# Altium schematic sheet CAN.SchDoc
size A4
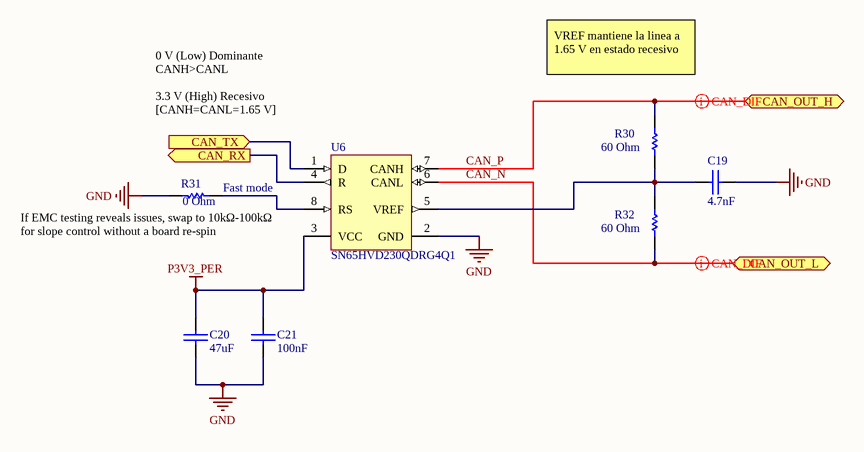
[diagram p0: CAN.SchDoc]

## Parts
C19  4.7nF  [0603C]
C20  47uF  [0603C]
C21  100nF  [0603C]
R30  60 Ohm  [0603R]
R31  0 Ohm  [0603R]
R32  60 Ohm  [0603R]
U6  SN65HVD230QDRG4Q1  [D0008A_M]

## Ports
CAN_OUT_H (bidir), CAN_OUT_L (bidir), CAN_RX (out), CAN_TX (in)

## Nets
GND: C19.2 C20.1 C21.1 R31.2 U6.2(GND)
P3V3_PER: C20.2 C21.2 U6.3(VCC)
CAN_N: R32.1 U6.6(CANL) ; port CAN_OUT_L
CAN_P: R30.2 U6.7(CANH) ; port CAN_OUT_H
CAN_RX: U6.4(R) ; port CAN_RX
CAN_TX: U6.1(D) ; port CAN_TX
NetC19_1: C19.1 R30.1 R32.2 U6.5(VREF)
NetR31_1: R31.1 U6.8(RS)

## Layout directives
differential pair: CAN_N, CAN_P

## Notes on the sheet
- VREF mantiene la linea a 1.65 V en estado recesivo
- 0 V (Low) Dominante CANH>CANL
  3.3 V (High) Recesivo  [CANH=CANL=1.65 V]
- (near R31) Fast mode
- (near R31) If EMC testing reveals issues, swap to 10kΩ-100kΩ for slope control without a board re-spin

## Library data of the parts
C19-C21 = CAP: Capacitor
R30 R32 = Res1: Resistor; Value: 60; Ordered by: Subcon; Published: 8-Jun-2000; Revision: July-2002: Re-released for DXP Platform.; Publisher: Altium Limited
R31 = Res1: Resistor; Value: 1K; Published: 8-Jun-2000; Revision: July-2002: Re-released for DXP Platform.; Publisher: Altium Limited
U6 = CMP-0315-00041-2: Automotive Catalog 3.3 V CAN Transceiver, 17 mA, -40 to 125 degC, 8-pin SOIC (D), Green (RoHS & no Sb/Br); Manufacturer: Texas Instruments; ICC(Max)(mA): 17; Drivers Per Package: 1; Supply Voltage(s)(V): 3.3; Transient Pulse Protection(V): -25 to 25; PackageDescription: 8-Pin Plastic Small Outline Integrated Circuit, 4.9 x 3.9 mm, Pitch 1.27 mm Pitch; SubFamily: CAN; Rating: Automotive; ComponentLink1Description: Datasheet; Receivers Per Package: 1; Isolated: No; DatasheetVersion: SGLS398A; PackageReference: D0008A; PartNumber: SN65HVD230QDRG4Q1; Code_JEDEC: MS-012AA; Footprint: PCA82C250; Eco-Plan: Green (RoHS & no Sb/Br); PackageVersion: revM, Jun-2011; ComponentLink1URL: http://www.ti.com/general/docs/lit/getliterature.tsp?genericPartNumber=SN65HVD230Q-Q1&fileType=pdf; Mounting Technology: Surface Mount